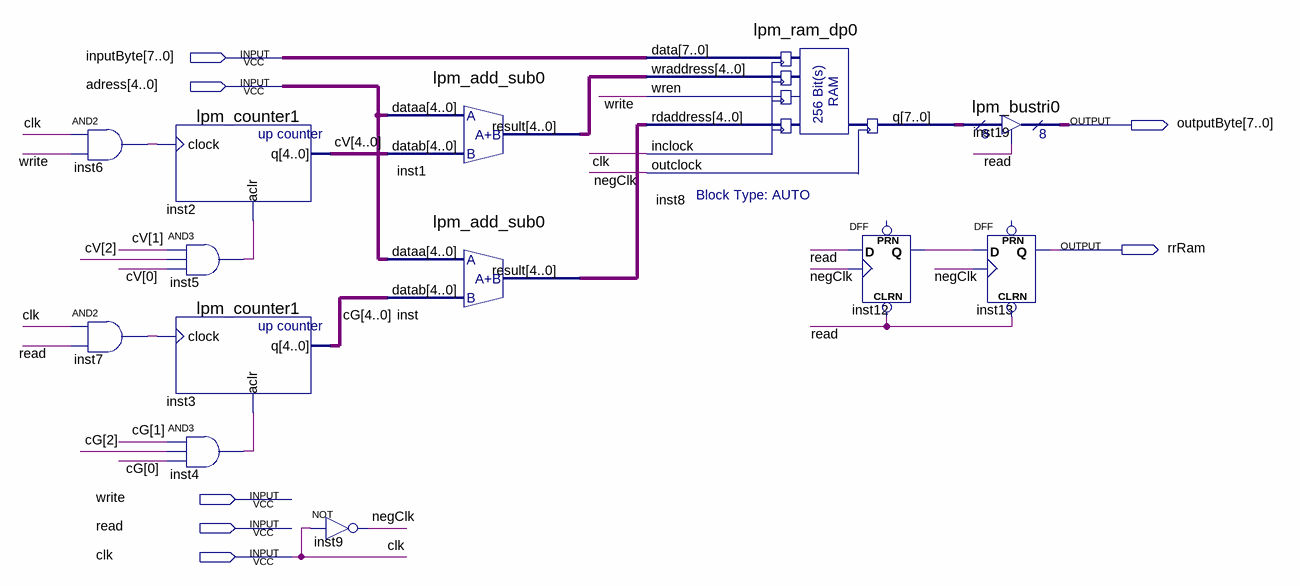
[diagram p0: schematic sheet]
// Quartus schematic Ram.bdf as structural Verilog: 13 symbols, 7 pins
module Ram (
  input  [7:0] inputByte,
  input  [4:0] adress,
  input  write,
  input  read,
  input  clk,
  output [7:0] outputByte,
  output rrRam
);

  wire inst4_out, inst5_out, inst6_out, inst7_out, inst12_q, negClk;
  wire [4:0] cG, cV, inst1_result, inst_result;
  wire [7:0] inst8_q;

  and inst6 (inst6_out, clk, write);
  and inst7 (inst7_out, clk, read);
  lpm_counter1 inst2 (.clock(inst6_out), .aclr(inst5_out), .q(cV));
  and inst5 (inst5_out, cV[1], cV[2], cV[0]);
  lpm_counter1 inst3 (.clock(inst7_out), .aclr(inst4_out), .q(cG));
  and inst4 (inst4_out, cG[1], cG[2], cG[0]);
  not inst9 (negClk, clk);
  lpm_add_sub0 inst1 (.dataa(adress), .datab(cV), .result(inst1_result));
  lpm_add_sub0 inst (.dataa(adress), .datab(cG), .result(inst_result));
  lpm_ram_dp0 inst8 (
    .data(inputByte), .wraddress(inst1_result), .wren(write), .rdaddress(inst_result), .inclock(clk),
    .outclock(negClk), .q(inst8_q));
  DFF inst12 (.CLRN(read), .CLK(negClk), .D(read), .Q(inst12_q));  // open: PRN
  lpm_bustri0 inst19 (.enabledt(read), .data(inst8_q), .tridata(outputByte));
  DFF inst13 (.CLRN(read), .CLK(negClk), .D(inst12_q), .Q(rrRam));  // open: PRN
endmodule
